# EAGLE design cdf-modular-bridge (EAGLE 7.3.0)
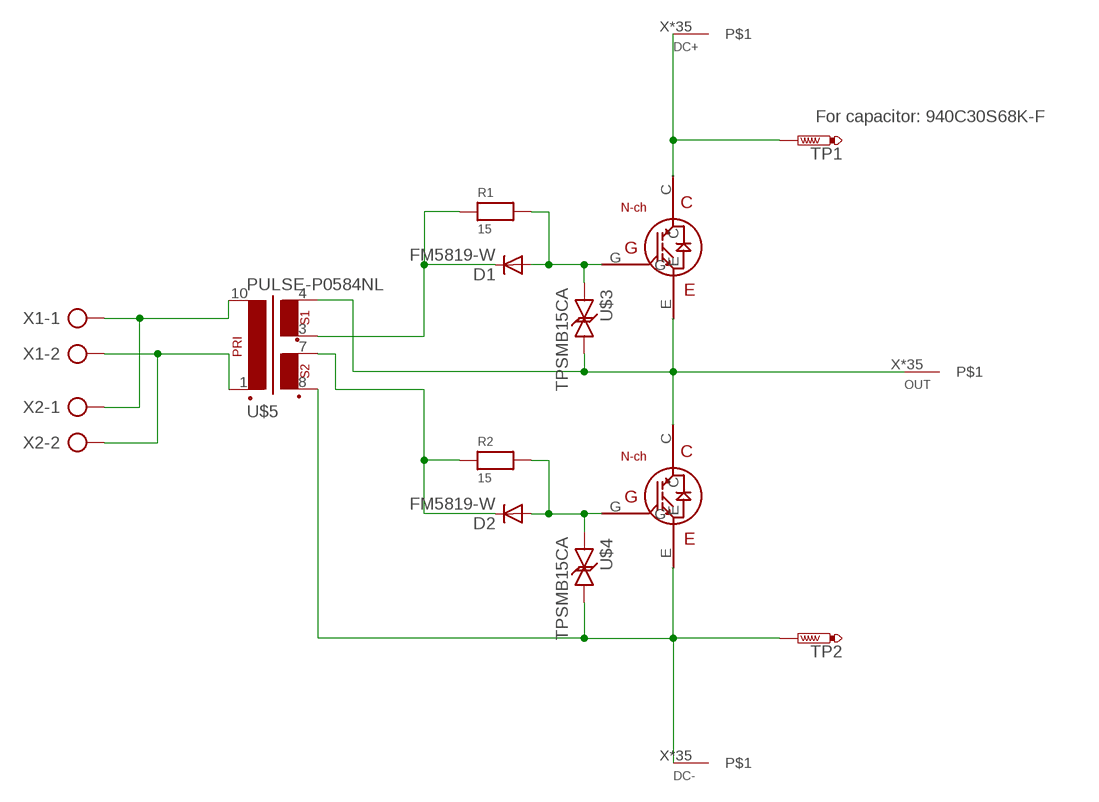
[diagram p0: schematic, sheet 1]

## Parts
D1  FM5819-W  S1A  [DO214AC]
D2  FM5819-W  S1A  [DO214AC]
DC+  BIG-ASS-HOLE  [BIG-ASS-HOLE]
DC-  BIG-ASS-HOLE  [BIG-ASS-HOLE]
OUT  BIG-ASS-HOLE  [BIG-ASS-HOLE]
R1  15  RESISTOR1206  [1206]
R2  15  RESISTOR1206  [1206]
TP1  PTR1PAD1-17  [P1-17]
TP2  PTR1PAD1-17  [P1-17]
U$1  Ixgh48n60a3  IXGH40N60A  [IXGH40N60A]
U$2  Ixgh48n60a3  IXGH40N60A  [IXGH40N60A]
U$3  TPSMB15CA  [TPSMB15CA]
U$4  TPSMB15CA  [TPSMB15CA]
U$5  PULSE-P0584NL  [PULSE-P0584NL]
X1  AK500/2  [AK500/2]
X2  AK500/2  [AK500/2]

## Nets
DC+: DC+.X DC+.X@1 DC+.X@2 DC+.X@3 DC+.X@4 DC+.X@5 DC+.X@6 DC+.X@7 DC+.X@8 DC+.X@9 DC+.X@10 DC+.X@11 DC+.X@12 DC+.X@13 DC+.X@14 DC+.X@15 DC+.X@16 DC+.X@17 DC+.X@18 DC+.X@19 DC+.X@20 DC+.X@21 DC+.X@22 DC+.X@23 DC+.X@24 DC+.X@25 DC+.X@26 DC+.X@27 DC+.X@28 DC+.X@29 DC+.X@30 DC+.X@31 DC+.X@32 DC+.X@34 DC+.X@120 TP1.TP U$1.C
DC-: DC-.X DC-.X@1 DC-.X@2 DC-.X@3 DC-.X@4 DC-.X@5 DC-.X@6 DC-.X@7 DC-.X@8 DC-.X@9 DC-.X@10 DC-.X@11 DC-.X@12 DC-.X@13 DC-.X@14 DC-.X@15 DC-.X@16 DC-.X@17 DC-.X@18 DC-.X@19 DC-.X@20 DC-.X@21 DC-.X@22 DC-.X@23 DC-.X@24 DC-.X@25 DC-.X@26 DC-.X@27 DC-.X@28 DC-.X@29 DC-.X@30 DC-.X@31 DC-.X@32 DC-.X@34 DC-.X@120 TP2.TP U$2.E U$4.P$2 U$5.8(SEC2_POS)
N$1: U$5.10(PRI_NEG) X1.1 X2.1
N$2: U$5.1(PRI_POS) X1.2 X2.2
N$3: D1.A R1.2 U$1.G U$3.P$1
N$5: D2.A R2.2 U$2.G U$4.P$1
N$7: D2.C R2.1 U$5.7(SEC2_NEG)
N$8: D1.C R1.1 U$5.3(SEC1_POS)
OUT: OUT.X OUT.X@1 OUT.X@2 OUT.X@3 OUT.X@4 OUT.X@5 OUT.X@6 OUT.X@7 OUT.X@8 OUT.X@9 OUT.X@10 OUT.X@11 OUT.X@12 OUT.X@13 OUT.X@14 OUT.X@15 OUT.X@16 OUT.X@17 OUT.X@18 OUT.X@19 OUT.X@20 OUT.X@21 OUT.X@22 OUT.X@23 OUT.X@24 OUT.X@25 OUT.X@26 OUT.X@27 OUT.X@28 OUT.X@29 OUT.X@30 OUT.X@31 OUT.X@32 OUT.X@34 OUT.X@120 U$1.E U$2.C U$3.P$2 U$5.4(SEC1_NEG)

## Notes on the sheet
- For capacitor: 940C30S68K-F

## Library data of the parts
D1 D2 = s1x_10:S1*: S1A - S1M General Purpose Rectifiers Source: http://www.fairchildsemi.com/datasheets/S1/S1A.pdf; MF: Fairchild; MPN: S1A; OC_FARNELL: 9843868; OC_NEWARK: 58K9551
DC+ DC- OUT = keves:BIG-ASS-HOLE
R1 R2 = microbuilder:RESISTOR: Resistors 0402 - 0402 Surface Mount Package 22 Ohm 1% 1/16W [Digikey: 311-22.0LRTR-ND] 33 Ohm 5% 1/16W 1.0K 5% 1/16W 1.5K 5% 1/16W 2.0K 1% 1/16W 10.0K 1% 1/16W [Digikey: 311-10.0KLRTR-ND] 10.0K 5% 1/16W [Digikey: RMCF0402JT10K0TR-ND] 12.1K 1% 1/16W [Digikey: 311-22.0LRTR-ND] 100.0K 5% 1/16W 0603 - 0603 Surface Mount Package 0 Ohm 1/10 Watt 1% Resistor 15 Ohm 1/10 Watt 1% Resistor 33 Ohm 1/10 Watt 1% Resistor 49.9 Ohm 1/10 Watt 1% Resistor 100 Ohm 1/10 Watt 1% Resistor 150 Ohm 1/10 Watt 1% Resistor 240 Ohm 1/10 Watt 1% Resistor 390 Ohm 1/10 Watt 1% Resistor 560 Ohm 1/10 Watt 1% Resistor 680 Ohm 1/10 Watt 1% Resistor 750 Ohm 1/10 Watt 1% Resistor 1.0K Ohm 1/10 Watt 1% Resistor 1.5K Ohm 1/10 Watt 1% Resistor 2.0K Ohm 1/10 Watt 1% Resistor 2.2K Ohm 1/10 Watt 1% Resistor 3.3K Ohm 1/10 Watt 1% Resistor 4.7K Ohm 1/10 Watt 1% Resistor 10.0K Ohm 1/10 Watt 1% Resistor 12.0K Ohm 1/10 Watt 1% Resistor 12.1K Ohm 1/10 Watt 1% Resistor 20.0K Ohm 1/10 Watt 1% Resistor 33.0K Ohm 1/10 Watt 1% Resistor 100.0K Ohm 1/10 Watt 1% Resistor 0805 - 0805 Surface Mount Package 0 Ohm 1/8 Watt 1% Resistor 33 Ohm 1/8 Watt 1% Resistor 100 Ohm 1/8 Watt 1% Resistor 150 Ohm 1/8 Watt 1% Resistor 200 Ohm 1/8 Watt 1% Resistor 240 Ohm 1/8 Watt 1% Resistor 330 Ohm 1/8 Watt 1% Resistor 390 Ohm 1/8 Watt 1% Resistor 470 Ohm 1/8 Watt 1% Resistor 1.0K Ohm 1/8 Watt 1% Resistor 1.5K Ohm 1/8 Watt 1% Resistor 2.0K Ohm 1/8 Watt 1% Resistor 4.7K Ohm 1/8 Watt 1% Resistor 5.1K Ohm 1/8 Watt 1% Resistor 5.6K Ohm 1/8 Watt 1% Resistor 10.0K Ohm 1/8 Watt 1% Resistor 22.0K Ohm 1/8 Watt 1% Resistor 33.0K Ohm 1/8 Watt 1% Resistor 100K Ohm 1/8 Watt 1% Resistor 1206 - 1206 Surface Mount Package 2012 - 2010 Surface Mount Package 0.11 Ohm 1/2 Watt 1% Resistor - Digikey: RHM.11UCT-ND
TP1 TP2 = testpad:PTR1: TEST PIN
U$1 U$2 = keves:IXGH40N60A
U$3 U$4 = keves:TPSMB15CA
U$5 = keves:PULSE-P0584NL
X1 X2 = con-ptr500:AK500/2: CONNECTOR; OC_FARNELL: unknown; OC_NEWARK: unknown

## Board
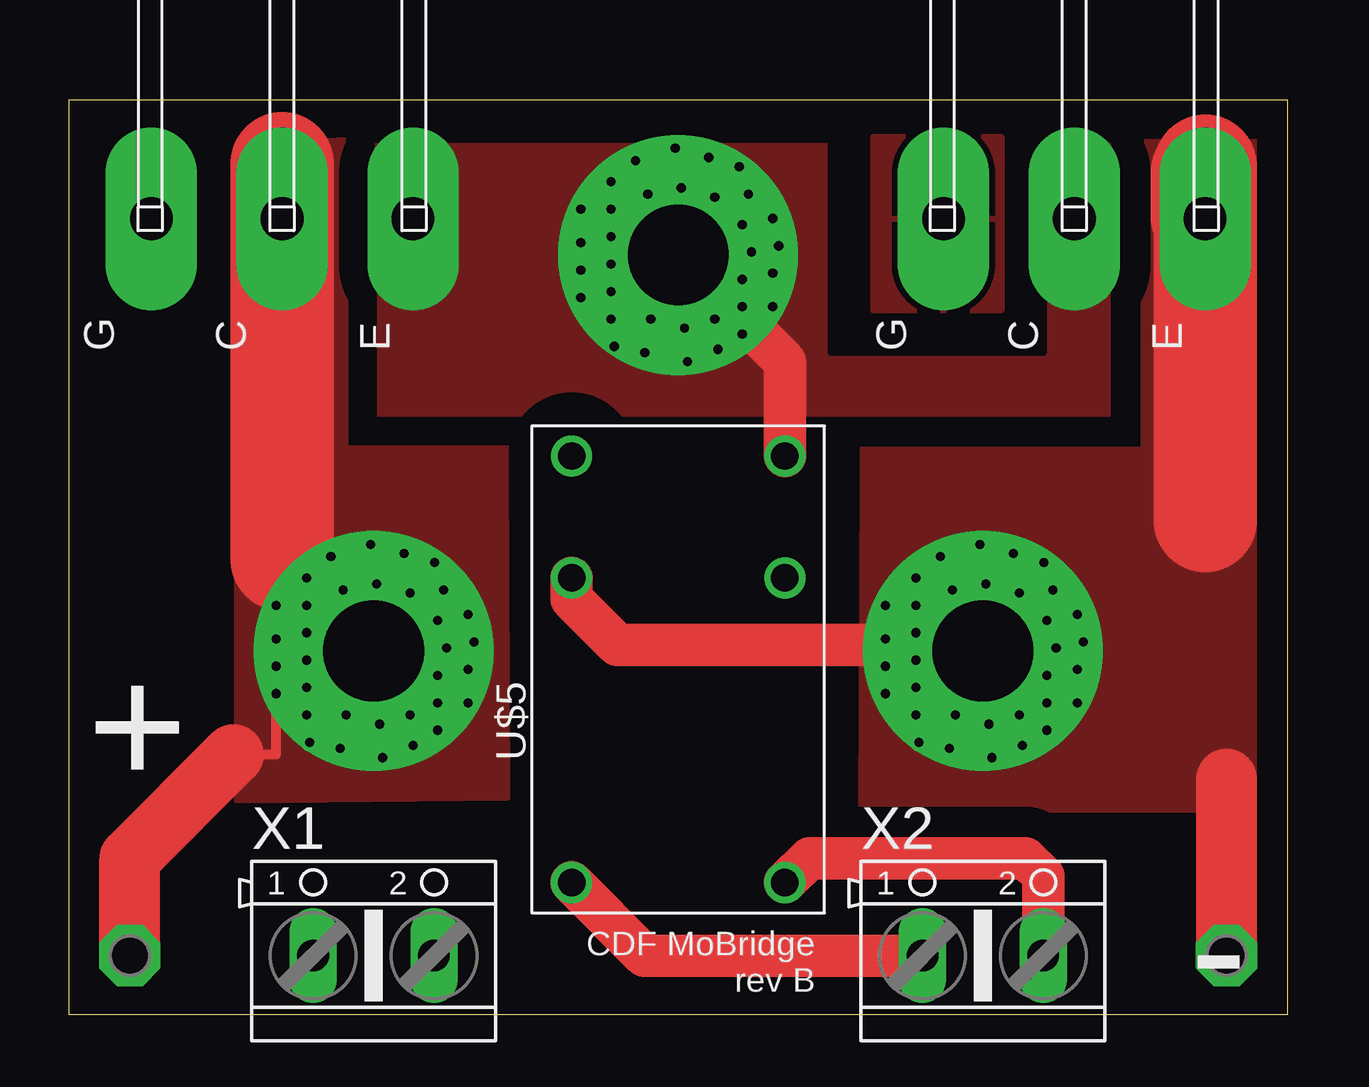
[diagram p1: board, top side]
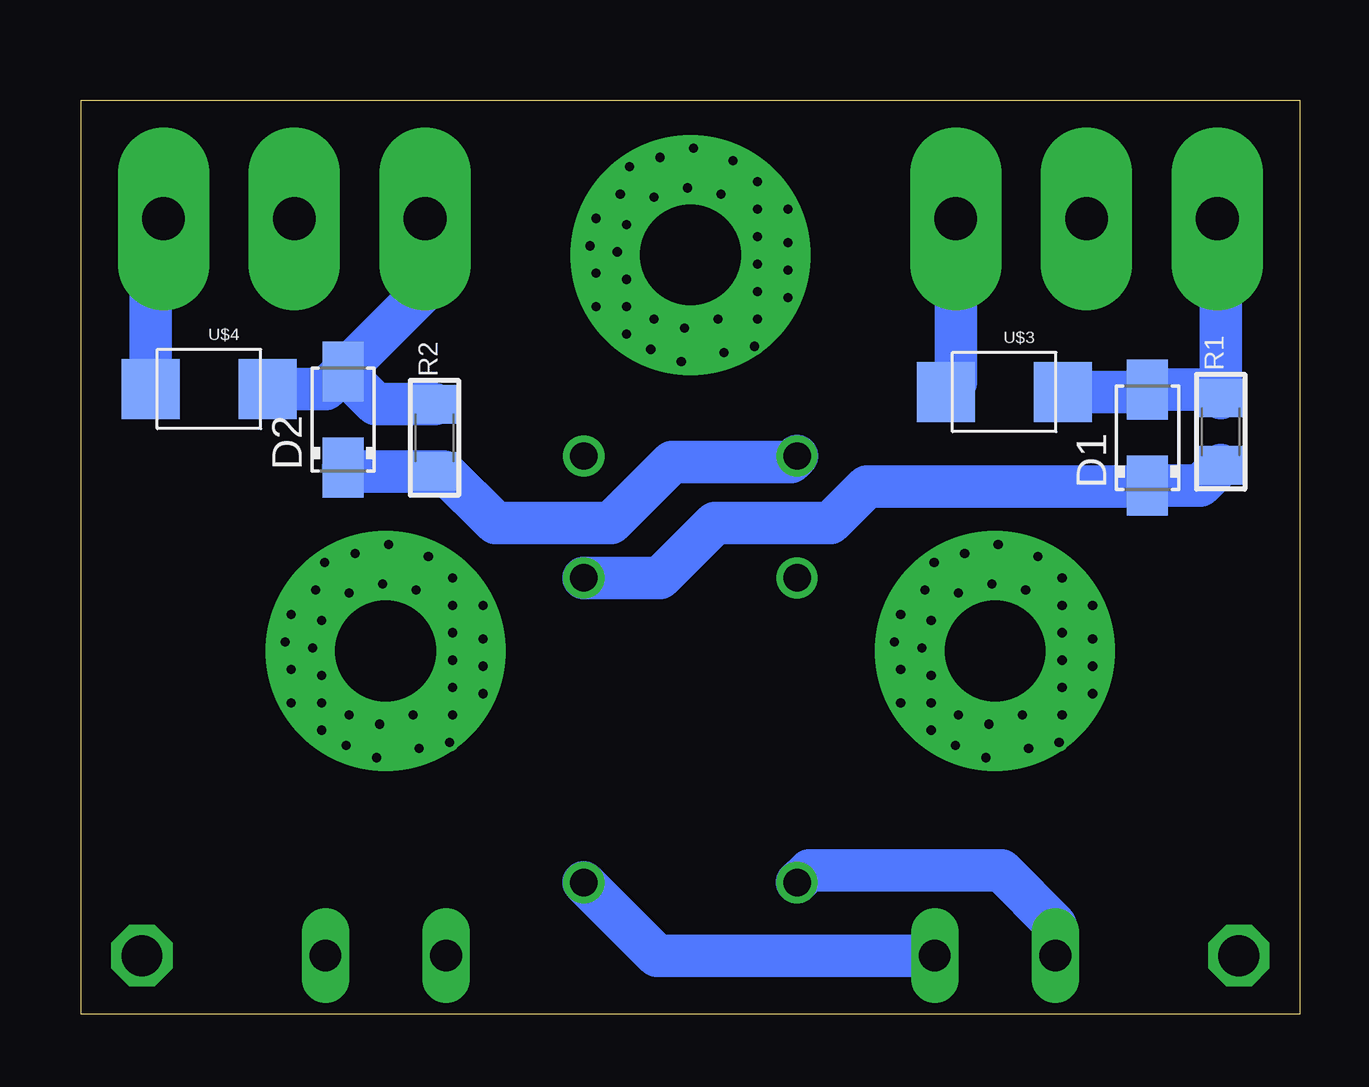
[diagram p2: board, bottom side, seen from below]

Size 50.8 x 38.1 mm. Coordinates in mm from the lower left corner, seen from the top.
Outline: 0,0 50.8,0 50.8,38.1 0,38.1 0,0
Copper layers (1*16): Top 0.0356mm / dielectric 1.5011mm / Bottom 0.0356mm
Design rules "oshpark *": minimum track width 6mil, minimum drill 13mil, track to track 6mil, track to pad 6mil, pad to pad 6mil, via to via 6mil, smd to smd 6mil, copper to edge 15mil, drill to drill 6mil, minimum pad ring 7mil, minimum via ring 7mil, stop-mask expansion 3mil, vias tented up to drill 0mil, thermal gap 10mil

### Footprints (pad centres in the part's own frame; a part is rotated, then mirrored left to right if it is on the bottom)
DO214AC = smd 2.5 x 1.7: A 2,0; C -2,0
BIG-ASS-HOLE = drill 4.2 pad 10: X 0,0 | drill 0.381: X@1 -2.794,-2.667; X@2 -2.794,-1.524; X@3 -2.794,-0.381; X@4 -2.794,0.762; X@5 -2.794,1.905; X@6 -2.794,3.048; X@7 2.54,3.683; X@8 2.921,2.54; X@9 -4.064,-1.778; X@10 -4.064,-0.635; X@11 -4.064,0.508; X@12 -4.064,1.905; X@13 2.667,1.27; X@14 3.048,0.127; X@15 2.667,-1.016; X@16 2.667,-2.159; X@17 2.667,-3.302; X@18 3.937,1.524; X@19 4.191,0.381; X@20 3.937,-0.762; X@21 3.937,-2.159; X@22 1.524,2.413; X@23 0.127,2.794; X@24 -1.27,2.54; X@25 -1.778,3.937; X@26 -0.127,4.445; X@27 1.27,4.064; X@28 1.524,-2.667; X@29 1.651,-3.937; X@30 0.254,-3.048; X@31 -1.143,-2.667; X@32 -1.397,-4.064; X@34 0.381,-4.445; X@120 -2.667,-3.81
1206 = smd 1.6 x 1.8: 1 -1.4,0; 2 1.4,0
P1-17 = drill 1.702 pad 2.54 octagon: TP 0,0
IXGH40N60A = drill 1.778 pad 3.81 long: C -44.21,0; E -44.21,-5.45; G -44.21,5.45
TPSMB15CA = smd 2.413 x 2.515: P$1 -2.438,0; P$2 2.438,0
PULSE-P0584NL = drill 1.143: 1 -12.7,-4.445; 3 0,-4.445; 4 5.08,-4.445; 7 5.08,4.445; 8 0,4.445; 10 -12.7,4.445
AK500/2 = drill 1.321 long: 1 -2.515,0; 2 2.515,0

### Placement (x,y rotation side)
D1  6.35,24.03 90 bottom
D2  39.88,24.79 90 bottom
DC+  12.7,15.14 0 top
DC-  38.1,15.14 0 top
OUT  25.4,31.65 0 top
R1  3.3,24.28 90 bottom
R2  36.07,24.03 90 bottom
TP1  2.54,2.44 0 top
TP2  48.26,2.44 0 top
U$1  8.89,77.37 90 top
U$2  41.91,77.37 90 top
U$3  12.32,25.93 180 bottom
U$4  45.47,26.06 180 bottom
U$5  25.4,18.19 90 top
X1  12.7,2.44 0 top
X2  38.1,2.44 0 top

### Tracks (layer width: path | path; a pad name or v marks a point on that pad's centre or on a via)
DC+
  Top 0.406: 6.86,10.82 8.64,10.82 DC+.X@9
  Top 2.54: TP1.TP 2.54,6.5 6.86,10.82
  Top 4.318: 8.89,18.95 U$1.C 8.89,35.46
  pour Top (isolate 1.194, rank 3, no thermals): 18.16,36.73 6.99,36.22 6.99,8.92 18.29,9.04
DC-
  Top 1.778: U$5.8 20.95,17.3 22.86,15.39 37.85,15.39 DC-.X
  Top 2.54: TP2.TP 48.26,9.8
  Top 4.318: 47.36,20.59 U$2.E | U$2.E 47.36,35.34 | 47.24,35.08 47.24,33.27 U$2.E
  Bottom 1.778: U$4.P$2 47.9,32.61 U$2.E
  pour Top (isolate 1.27, rank 3, no thermals): 50.16,36.35 33.15,36.35 33.02,8.53 50.04,8.53
N$1
  Top 1.778: X2.1 24,2.44 U$5.10
  Bottom 1.778: X1.1 10.19,3.73 12.45,5.99 20.45,5.99 U$5.10
N$2
  Top 1.778: X2.2 40.62,5.77 39.88,6.5 30.86,6.5 U$5.1
  Bottom 1.778: X1.2 26.8,2.44 U$5.1
N$3
  Bottom 1.778: U$3.P$1 6.45,25.93 D1.A 3.65,26.03 R1.2 3.3,33.02 U$1.G
N$5
  Bottom 1.778: U$4.P$1 40.61,26.06 D2.A | R2.2 38.52,25.43 D2.A | U$2.G 36.46,30.21 D2.A
  pour Top: 33.53,36.58 38.86,36.58 38.86,29.34 33.53,29.34
N$7
  Bottom 1.778: D2.C 39.72,22.63 R2.1 35.68,22.63 33.53,20.47 28.7,20.47 26.16,23.01 21.21,23.01 U$5.7
N$8
  Bottom 1.778: R1.1 4.16,22.03 D1.C 6.38,22 18.03,22 19.56,20.47 24.38,20.47 26.67,18.19 U$5.3
OUT
  Top 1.778: U$5.4 29.84,27.2 OUT.X
  Bottom 1.778: U$1.E 14.34,26.35 U$3.P$2
  pour Top (isolate 1.778, rank 2, no thermals): 43.81,38.51 12.45,38.51 12.45,25.04 43.81,25.04

### Text on the board
tPlace: + | CDF MoBridge / rev B | -